# EasyEDA Pro project Commuta_PCBv1.epro

# Schematic Schematic1
Assembly Variant: Basic; Board Name: Board1; Create Date: 2026-05-24; Page Name: P1; Project Name: 便携式空气质量检测设备; Schematic Name: Schematic1; Update Date: 2026-05-24; Company: 嘉立创EDA; Page Size: A4; Version: V1.0
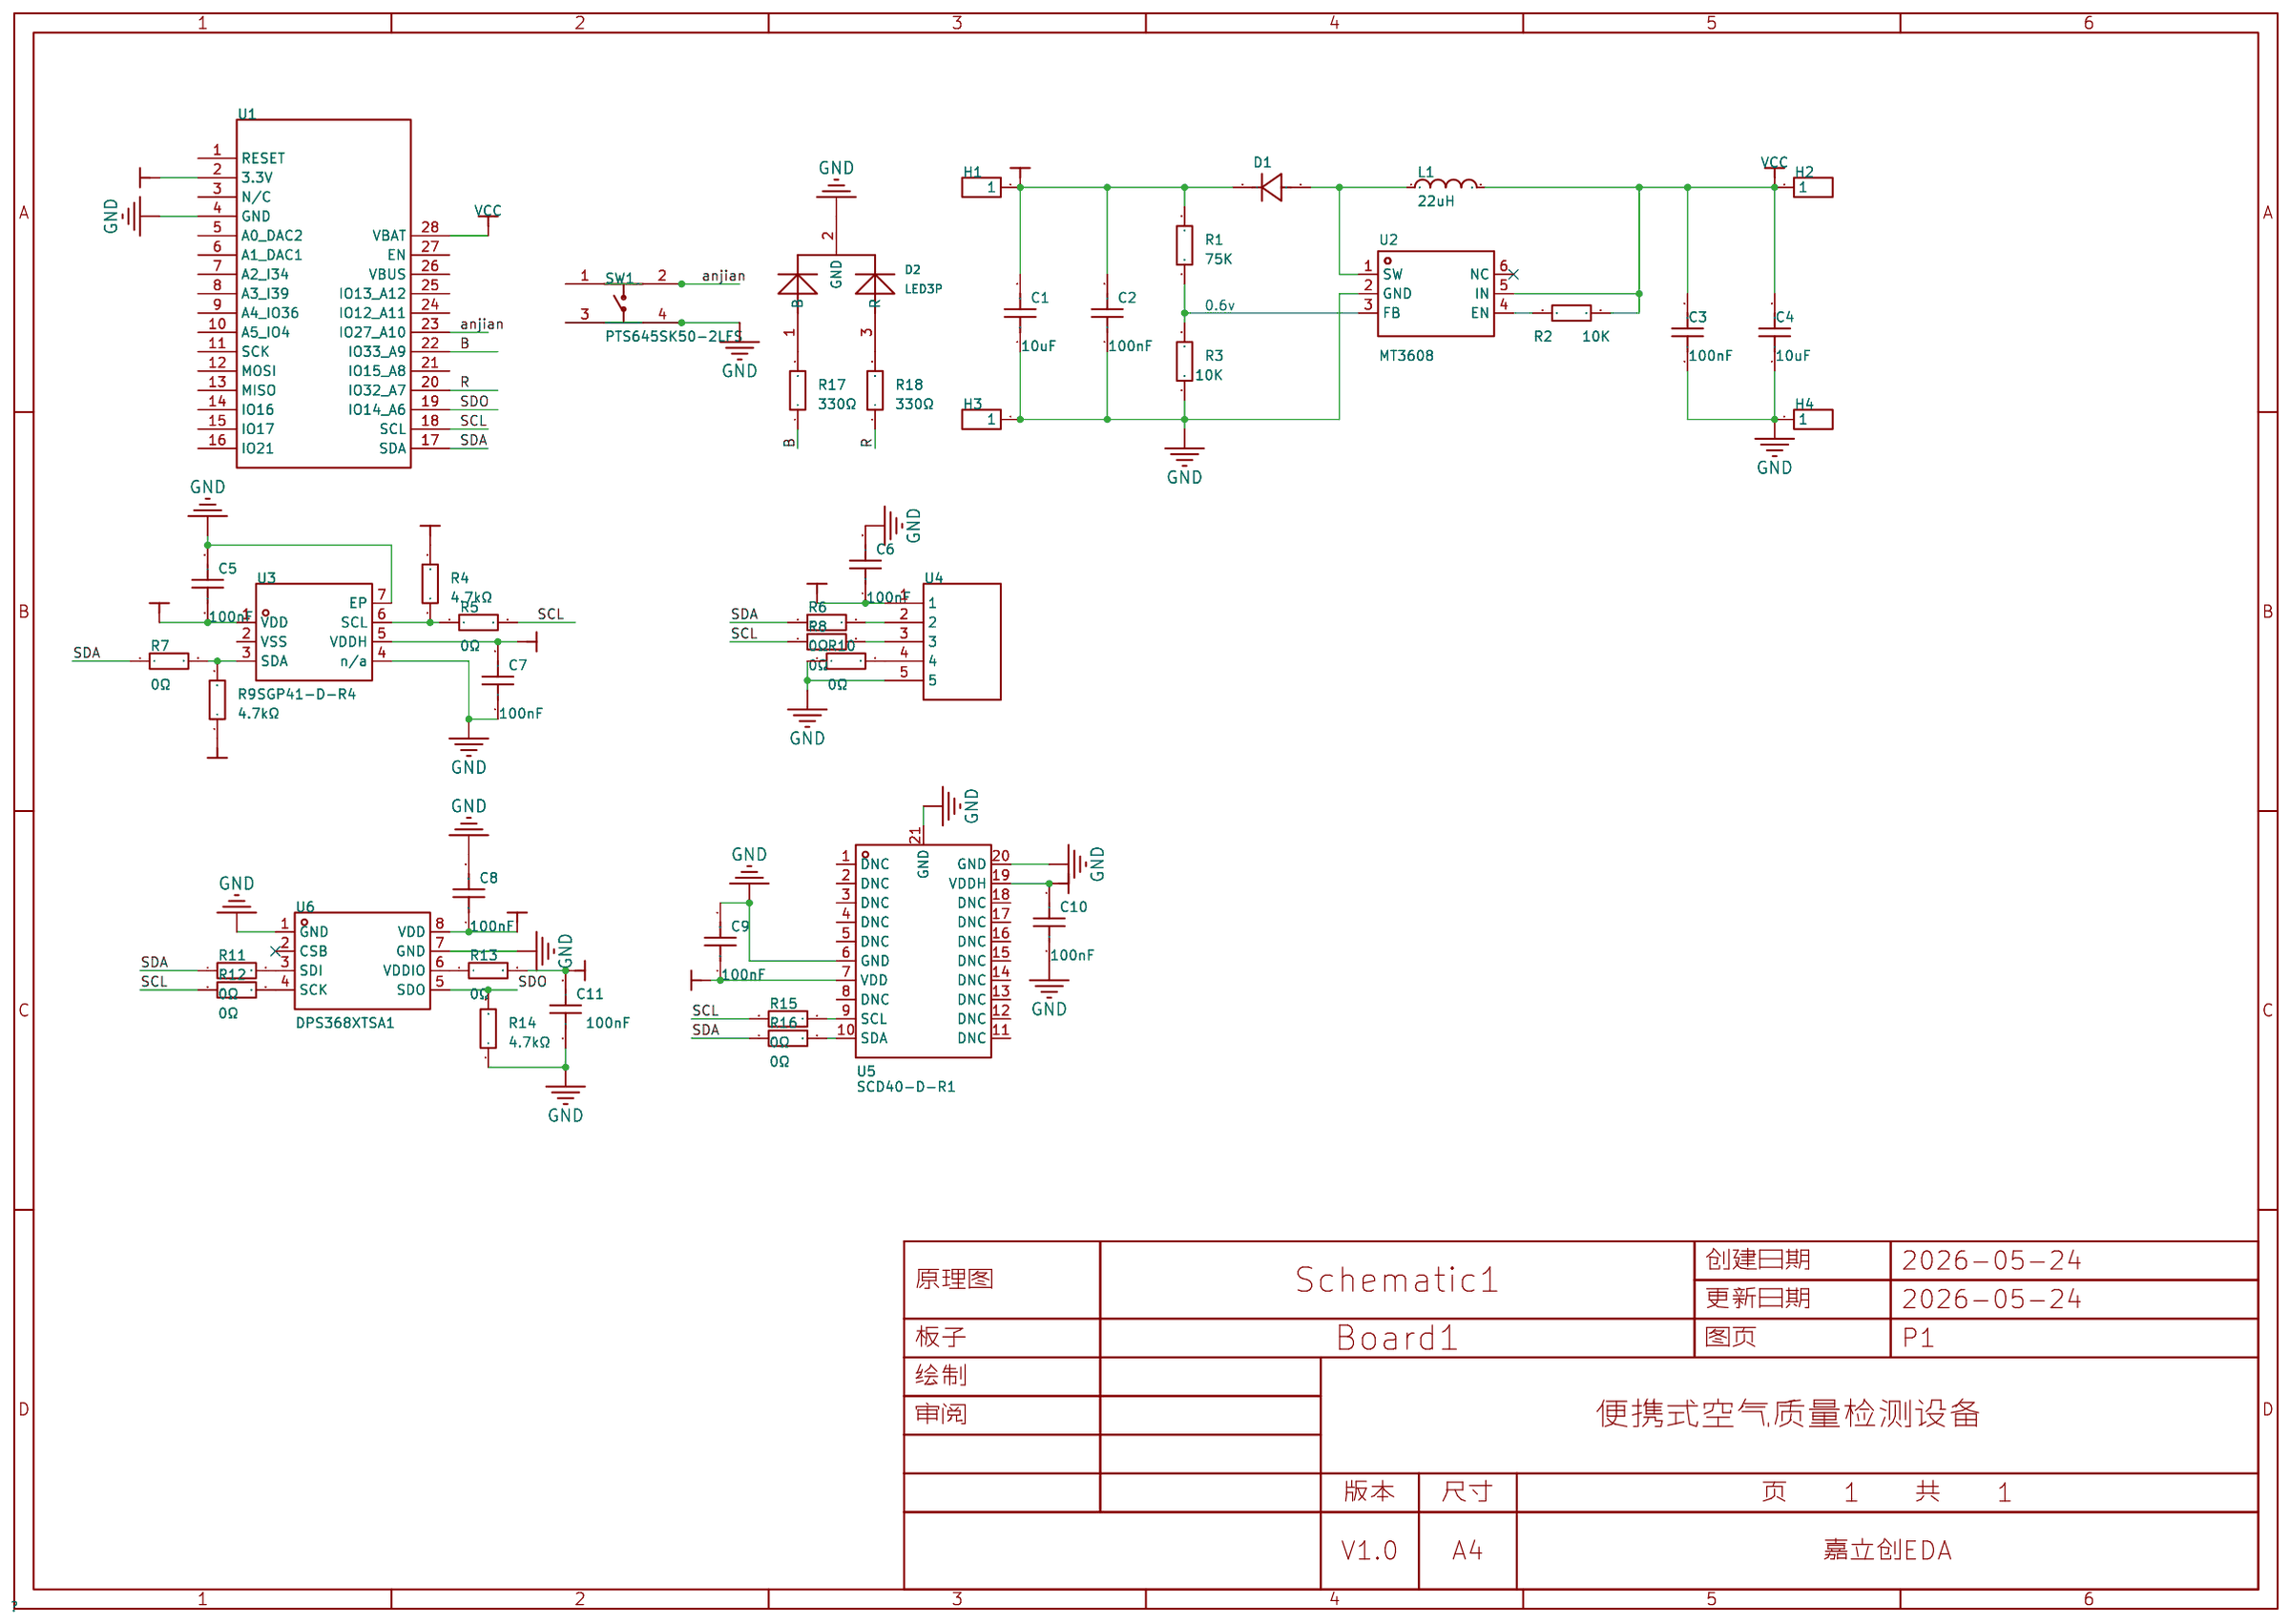
[diagram p0: schematic sheet]

## Parts
C1  10uF  [C0805]
C2  100nF  [C0805]
C3  100nF  [C0805]
C4  10uF  [C0805]
C5  100nF  [C0805]
C6  100nF  [C0805]
C7  100nF  [C0805]
C8  100nF  [C0805]
C9  100nF  [C0805]
C10  100nF  [C0805]
C11  100nF  [C0805]
D1  -  [SMA_1N4007]
D2  LED3P  [LED3P]
H1  -  [HDR-TH_1P-V-M_XKB_X4611WV-01I-C28D40]
H2  -  [HDR-TH_1P-V-M_XKB_X4611WV-01I-C28D40]
H3  -  [HDR-TH_1P-V-M_XKB_X4611WV-01I-C28D40]
H4  -  [HDR-TH_1P-V-M_XKB_X4611WV-01I-C28D40]
L1  22uH  [IND-SMD_L6.0-W5.2_SUMIDA_CDH53]
R1  75K  [R0603]
R2  10K  [R0603]
R3  10K  [R0603]
R4  4.7kΩ  [R0603]
R5  0Ω  [R0603]
R6  0Ω  [R0603]
R7  0Ω  [R0603]
R8  0Ω  [R0603]
R9  4.7kΩ  [R0603]
R10  0Ω  [R0603]
R11  0Ω  [R0603]
R12  0Ω  [R0603]
R13  0Ω  [R0603]
R14  4.7kΩ  [R0603]
R15  0Ω  [R0603]
R16  0Ω  [R0603]
R17  330Ω  [R1206]
R18  330Ω  [R1206]
SW1  PTS645SK50-2LFS  [KEY-TH_4P-L6.0-W6.0-P4.50-LS6.50]
U1  -  [HUZZAH32 ESP32]
U2  MT3608  [SOT-23-6_L2.9-W1.6-P0.95-LS2.8-BL]
U3  SGP41-D-R4  [DFN-6_L2.4-W2.4-P0.80-TL-EP]
U4  -  [CONN-TH_5P-P2.50_HX-2.54MM-5P-ZZ]
U5  SCD40-D-R1  [LGA-20_L10.1-W10.1-P1.25-TL]
U6  DPS368XTSA1  [LGA-8_L2.5-W2.0-P0.65-TR_DPS368]

## Library data of the parts
C1-C11 = CAP_0603: Supplier Footprint: 0603
D1 = D_1N4007: Supplier Footprint: SMA
D2 = LED3P: 双色LED灯
H1-H4 = HDR-M_2.54_1x1P: Supplier Part: C81276; Supplier Footprint: 插件; JLCPCB Part Class: Extended Part
L1 = PCR0530-220-M: 电感值:22uH;精度:±20%;额定电流:2A;饱和电流(Isat):2.5A;类型:一体成型电感;; LCSC Part Name: 22μH ±20% 2A; Supplier Part: C53896868; Manufacturer: JIERR(捷而瑞); Supplier Footprint: SMD,6x5.2mm; JLCPCB Part Class: Extended Part; Datasheet: https://item.szlcsc.com/datasheet/PCR0530-220-M/57092550.html; Supplier: LCSC; Tolerance: ±20%; Current Rating: 2A; Current - Saturation(Isat): 2.5A; DC Resistance(DCR): 260mΩ; Type: 一体成型电感
R1-R3 = Res_0603: Supplier Footprint: 0603
R4 R9 R14 = RC0603FR-074K7L: 电阻类型:厚膜电阻;阻值:4.7kΩ;精度:±1%;功率:100mW;工作电压:75V;温度系数:±100ppm/℃;; LCSC Part Name: 厚膜电阻 4.7kΩ ±1% 100mW; Supplier Part: C99782; Manufacturer: YAGEO(国巨); Supplier Footprint: 0603; JLCPCB Part Class: Extended Part; Datasheet: https://item.szlcsc.com/datasheet/RC0603FR-074K7L/100996.html; Supplier: LCSC; Type: 厚膜电阻; Tolerance: ±1%; Power(Watts): 100mW; Voltage-Supply(Max): 75V; Temperature Coefficient: ±100ppm/℃; Operating Temperature: -55℃~+155℃
R5-R8 R10-R13 R15 R16 = RC0603FR-070RL: 电阻类型:厚膜电阻;阻值:0Ω;精度:±1%;功率:100mW;工作电压:75V;温度系数:-;; LCSC Part Name: 厚膜电阻 0Ω ±1% 100mW; Supplier Part: C100044; Manufacturer: YAGEO(国巨); Supplier Footprint: 0603; JLCPCB Part Class: Extended Part; Datasheet: https://item.szlcsc.com/datasheet/RC0603FR-070RL/101258.html; Supplier: LCSC; Type: 厚膜电阻; Tolerance: ±1%; Power(Watts): 100mW; Voltage-Supply(Max): 75V; Operating Temperature: -55℃~+155℃
R17 R18 = 1206W4J0331T5E: 电阻类型:厚膜电阻;阻值:330Ω;精度:±5%;功率:250mW;工作电压:200V;温度系数:±100ppm/℃;; LCSC Part Name: 330Ω ±5% 250mW 厚膜电阻; Supplier Part: C25374; Manufacturer: UNI-ROYAL(厚声); Supplier Footprint: 1206; JLCPCB Part Class: Extended Part; Datasheet: https://item.szlcsc.com/datasheet/1206W4J0331T5E/26117.html; Supplier: LCSC; Type: 厚膜电阻; Tolerance: ±5%; Power(Watts): 250mW; Voltage-Supply(Max): 200V; Temperature Coefficient: ±100ppm/℃; Operating Temperature: -55℃~+155℃
SW1 = PTS645SK50-2LFS: 电路结构:单刀单掷;按钮形状:圆形按钮;作用力:2.6N;安装方式:直插;开关长度:6mm;开关宽度:6mm;带支架:不带支架;触点电流:50mA;额定电压:12V;带灯:无;工作寿命:10万次;; LCSC Part Name: 6mm*6mm 12V 50mA; Supplier Part: C2689653; Manufacturer: C&K; Supplier Footprint: 插件-4P,6x6mm; JLCPCB Part Class: Extended Part; Datasheet: https://item.szlcsc.com/datasheet/PTS645SK50-2LFS/2796858.html; Supplier: LCSC; Circuit: 单刀单掷; Actuator Style: 圆形按钮; Operating Force: 2.6N; Mounting Type: 直插; Length: 6mm; Width: 6mm; with Bracket: 不带支架; Contact Current: 50mA; Voltage Rating: 12V; With Lamp: 无; Termination Style: PC引脚; Life: 10万次
U1 = HUZZAH32 ESP32
U2 = MT3608: 功能类型:升压型;输入电压:2V~24V;输出电压:28V;输出电流(最大值):-;; LCSC Part Name: 升压型 输入2V~24V 输出28V; Supplier Part: C84817; Manufacturer: 西安航天民芯; Supplier Footprint: SOT-23-6; JLCPCB Part Class: Extended Part; Datasheet: https://atta.szlcsc.com/upload/public/pdf/source/20161110/1478743351706.pdf; Supplier: LCSC; Function: 升压型; Number of Outputs: 1; Topology: 升压式; Input Voltage: 2V~24V; Output Voltage: 28V; Switching Frequency: 1.2MHz
U3 = SGP41-D-R4: VOC（挥发性有机化合物）和Nox （氮氧化合物） 传感器（用于智能调节空气处理设备）; LCSC Part Name: 3.000.060 3.000.060 适用于室内空气质量应用的 VOC 与 NOx 传感器; Supplier Part: C3659325; Manufacturer: Sensirion(瑞士盛思锐); Supplier Footprint: DFN-6(2.4x2.4); JLCPCB Part Class: Extended Part; Datasheet: https://item.szlcsc.com/datasheet/SGP41-D-R4/4227122.html; Supplier: LCSC
U4 = SPS30传感器
U5 = SCD40-D-R1: 气体类型:空气质量;测量范围:0ppm~40000ppm;接口类型:I2C;精度:±5%;; LCSC Part Name: 3.000.496 3.000.496 紧凑且具成本效益的光声式 NDIR CO₂ 二氧化碳传感器; Supplier Part: C3037696; Manufacturer: Sensirion(瑞士盛思锐); Supplier Footprint: SMD; JLCPCB Part Class: Extended Part; Datasheet: https://item.szlcsc.com/datasheet/SCD40-D-R1/3589639.html; Supplier: LCSC; Type: 空气质量; Measurement Range: 0ppm~40000ppm; Voltage - Supply: 2.4V~5.5V; Interface: I2C; Tolerance: ±5%; Operating Temperature: -10℃~+60℃; Length: 10.1mm; Width: 10.1mm; Height: 6.5mm; Current - Supply: 0.36mA; Features: 复位功能
U6 = DPS368XTSA1: 压力范围:30Kpa~1.2bar;接口类型:I2C；SPI;; LCSC Part Name: 数字式气压传感器; Supplier Part: C3232508; Manufacturer: Infineon(英飞凌); Supplier Footprint: VLGA-8(2x2.5); JLCPCB Part Class: Extended Part; Datasheet: https://item.szlcsc.com/datasheet/DPS368XTSA1/3795529.html; Supplier: LCSC; Pressure range: 30Kpa~1.2bar; Voltage - Supply: 1.7V~3.6V; Standby Current: 500nA; Interface: I2C；SPI; Module: 否; Absolute Accuracy: 100pa; Relative Accuracy: 6pa; Features: 待机模式；集成ADC与数字接口；片内温度补偿；片内校准与非易失存储；片内温度输出; Temperature Coefficient of Offset(TCO): 0.5pa/K; Response time: 27.6ms; Operating Temperature: -40℃~+85℃

## Nets
+3.3V: C5.1 C7.2 C8.1 C9.1 C10.2 C11.2 R4.2 R9.1 R13.2 U1.2(3.3V) U3.1(VDD) U3.5(VDDH) U5.7(VDD) U5.19(VDDH) U6.8(VDD)
+5V: C1.2 C2.2 C6.1 D1.1(K) H1.1 R1.2 U4.1
GND: C1.1 C2.1 C3.1 C4.1 C5.2 C6.2 C7.1 C8.2 C9.2 C10.1 C11.1 D2.2(GND) H3.1 H4.1 R3.1 R10.1 R14.1 SW1.3 SW1.4 U1.4(GND) U2.2(GND) U3.4(n/a) U3.7(EP) U4.5 U5.6(GND) U5.20(GND) U5.21(GND) U6.1(GND) U6.7(GND)
VCC: C3.2 C4.2 H2.1 L1.2 R2.2 U1.28(VBAT) U2.5(IN)
anjian: SW1.1 SW1.2 U1.23(IO27_A10)
B: R17.1 U1.22(IO33_A9)
R: R18.1 U1.20(IO32_A7)
SCL: R5.2 R8.1 R12.1 R15.2 U1.18(SCL)
SDA: R6.1 R7.1 R11.1 R16.1 U1.17(SDA)
SDO: R14.2 U1.19(IO14_A6) U6.5(SDO)
$1N2: R2.1 U2.4(EN)
$1N7: R1.1 R3.2 U2.3(FB)
$1N8: D1.2(A) L1.1 U2.1(SW)
$1N12: R11.2 U6.3(SDI)
$1N13: R12.2 U6.4(SCK)
$1N14: R7.2 R9.2 U3.3(SDA)
$1N15: R4.1 R5.1 U3.6(SCL)
$1N22: R13.1 U6.6(VDDIO)
$1N48: R10.2 U4.4
$1N49: R6.2 U4.2
$1N50: R8.2 U4.3
$1N56: R15.1 U5.9(SCL)
$1N57: R16.2 U5.10(SDA)
$1N69: D2.1(B) R17.2
$1N70: D2.3(R) R18.2

Not connected (* = marked no-connect by the designer): U1 1(RESET) 3(N/C) 5(A0_DAC2) 6(A1_DAC1) 7(A2_I34) 8(A3_I39) 9(A4_IO36) 10(A5_IO4) 11(SCK) 12(MOSI) 13(MISO) 14(IO16) 15(IO17) 16(IO21) 21(IO15_A8) 24(IO12_A11) 25(IO13_A12) 26(VBUS) 27(EN); U2 6(NC)*; U3 2(VSS); U5 1(DNC) 2(DNC) 3(DNC) 4(DNC) 5(DNC) 8(DNC) 11(DNC) 12(DNC) 13(DNC) 14(DNC) 15(DNC) 16(DNC) 17(DNC) 18(DNC); U6 2(CSB)*

## Notes on the sheet
- 0.6v

# Board PCB1
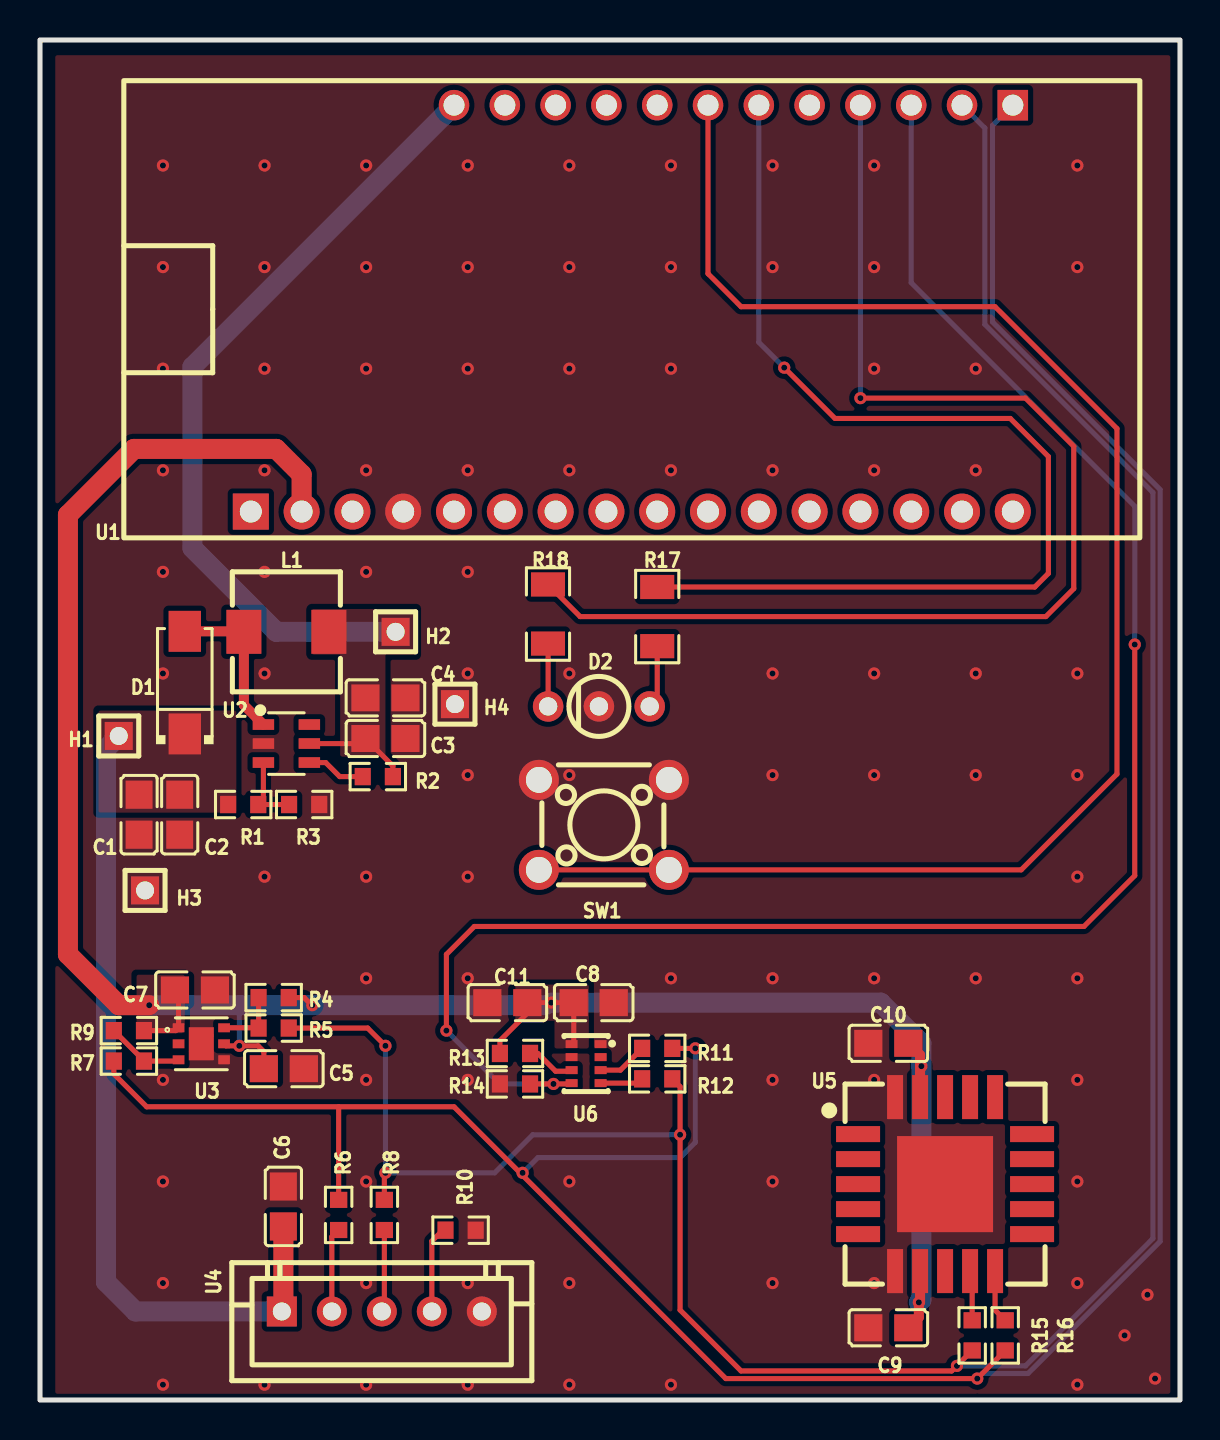
[diagram p1: board, top side]
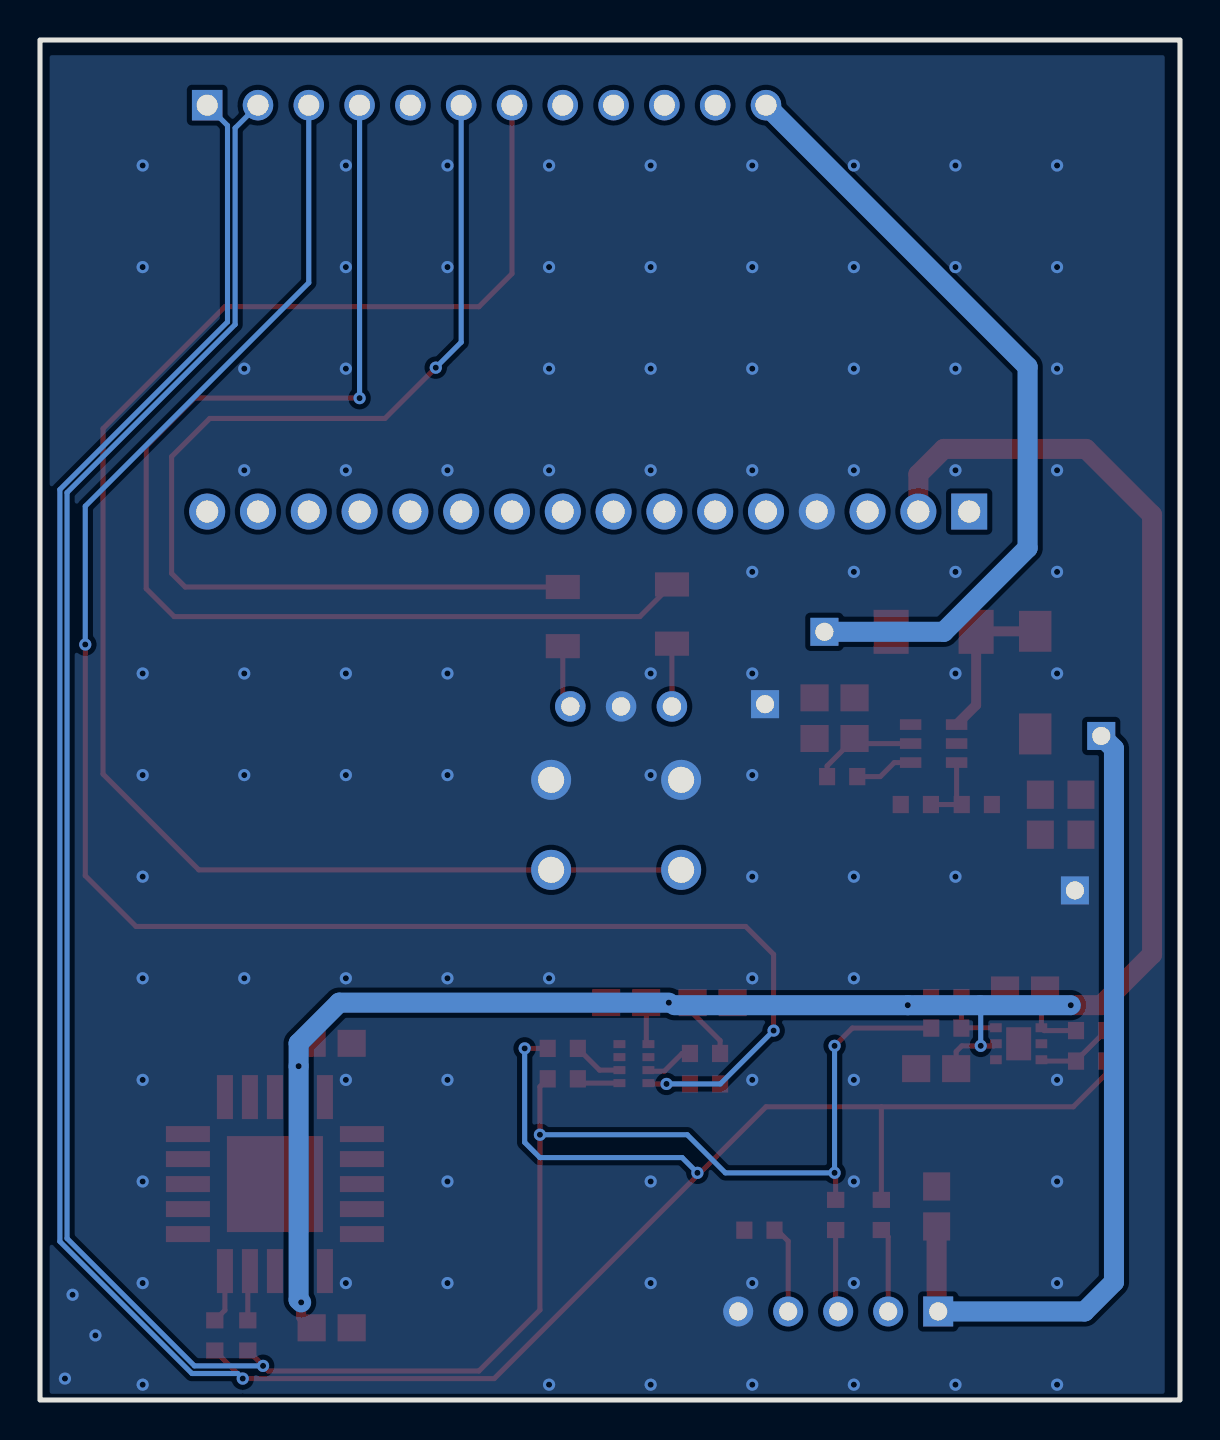
[diagram p2: board, bottom side, seen from below]

Outline 57 x 68 mm; copper layers: Top Layer, Bottom Layer. Coordinates in mm from the lower left corner of the outline.
Outline path: rectangle 0,68 57,0
Stack: Top Layer 0.035mm / Dielectric1 1.51mm FR4 er 4.5 / Bottom Layer 0.035mm

## Design rules (mm)
spacing copperThickness1oz (default): track to track 0.102, other pairs 0.152 to 0.3
spacing copperThickness2oz: track to track 0.203, other pairs 0.152 to 0.3
track width copperThickness1oz (default): min 0.127, default 0.254, max 2.54
track width copperThickness2oz: min 0.203, default 0.254, max 2.54
differential pair differentialPair (default): width min 0.127, default 0.254, max 2.54; gap min 0.152, default 0.152
net +3.3V uses copperRegion_copperThickness2oz, copperThickness2oz
pour e222 uses copperRegion_copperThickness2oz, copperThickness2oz
net GND uses copperRegion_copperThickness1oz
net VCC uses copperRegion_copperThickness1oz
net +5V uses copperRegion_copperThickness1oz

## Placement (name value [footprint] x y rotation side)
C1  10uF  [C0805]  4.95 29.27 90 top
C2  100nF  [C0805]  6.98 29.27 90 top
C3  100nF  [C0805]  17.27 33.08 180 top
C4  10uF  [C0805]  17.27 35.11 180 top
C5  100nF  [C0805]  12.19 16.57 0 top
C6  100nF  [C0805]  12.17 9.68 90 top
C7  100nF  [C0805]  7.75 20.5 180 top
C8  100nF  [C0805]  27.69 19.87 0 top
C9  100nF  [C0805]  42.42 3.61 180 top
C10  100nF  [C0805]  42.42 17.84 0 top
C11  100nF  [C0805]  23.37 19.87 0 top
D1  -  [SMA_1N4007]  7.24 35.87 90 top
D2  -  [LED3P]  30.49 34.68 180 top
H1  -  [HDR-TH_1P-V-M_XKB_X4611WV-01I-C28D40]  3.94 33.2 90 top
H2  -  [HDR-TH_1P-V-M_XKB_X4611WV-01I-C28D40]  17.78 38.41 90 top
H3  -  [HDR-TH_1P-V-M_XKB_X4611WV-01I-C28D40]  5.25 25.48 90 top
H4  -  [HDR-TH_1P-V-M_XKB_X4611WV-01I-C28D40]  20.75 34.79 90 top
L1  22uH  [IND-SMD_L6.0-W5.2_SUMIDA_CDH53]  12.32 38.41 90 top
R1  75K  [R0603]  10.16 29.77 180 top
R2  10K  [R0603]  16.89 31.17 0 top
R3  10K  [R0603]  13.21 29.77 180 top
R4  4.7kΩ  [R0603]  11.68 20.12 0 top
R5  0Ω  [R0603]  11.68 18.6 0 top
R6  0Ω  [R0603]  14.93 9.25 270 top
R7  0Ω  [R0603]  4.44 16.95 0 top
R8  0Ω  [R0603]  17.22 9.25 270 top
R9  4.7kΩ  [R0603]  4.44 18.47 180 top
R10  0Ω  [R0603]  21.03 8.49 180 top
R11  0Ω  [R0603]  30.86 17.58 180 top
R12  0Ω  [R0603]  30.86 16.06 180 top
R13  0Ω  [R0603]  23.75 17.33 180 top
R14  4.7kΩ  [R0603]  23.75 15.8 0 top
R15  0Ω  [R0603]  46.61 3.23 270 top
R16  0Ω  [R0603]  48.26 3.23 90 top
R17  330Ω  [R1206]  30.86 39.17 270 top
R18  330Ω  [R1206]  25.4 39.3 270 top
SW1  PTS645SK50-2LFS  [KEY-TH_4P-L6.0-W6.0-P4.50-LS6.50]  28.19 28.76 180 top
U1  -  [HUZZAH32 ESP32]  54.99 43.11 90 top
U2  MT3608  [SOT-23-6_L2.9-W1.6-P0.95-LS2.8-BL]  12.32 32.82 270 top
U3  SGP41-D-R4  [DFN-6_L2.4-W2.4-P0.80-TL-EP]  8.07 17.81 0 top
U4  -  [CONN-TH_5P-P2.50_HX-2.54MM-5P-ZZ]  17.09 4.43 0 top
U5  SCD40-D-R1  [LGA-20_L10.1-W10.1-P1.25-TL]  45.25 10.8 0 top
U6  DPS368XTSA1  [LGA-8_L2.5-W2.0-P0.65-TR_DPS368]  27.31 16.82 0 top

## Footprints (pads in the part's own frame, mm; a bottom-side part is the same pattern mirrored in y, then rotated)
C0805
  rect 1.41x1.35 smd: 1(-1,0) 2(1,0)
CONN-TH_5P-P2.50_HX-2.54MM-5P-ZZ
  rect 1.5x1.5 hole 0.9: 1(-5,0)
  round 1.5 hole 0.9: 2(-2.5,0) 3(0,0) 4(2.5,0) 5(5,0)
DFN-6_L2.4-W2.4-P0.80-TL-EP
  rect 0.585x0.448 smd: 1(-1.137,0.8) 2(-1.137,0) 3(-1.137,-0.8) 4(1.137,-0.8) 5(1.137,0) 6(1.137,0.8)
  rect 1.25x1.65 smd: 7(0,0)
HDR-TH_1P-V-M_XKB_X4611WV-01I-C28D40
  rect 1.4x1.4 hole 0.9: 1(0,0)
HUZZAH32 ESP32
  rect 1.8x1.8 hole 1.1: 1(1.313,44.45)
  round 1.8 hole 1.1: 2(1.313,41.91) 3(1.313,39.37) 4(1.313,36.83) 5(1.313,34.29) 6(1.313,31.75) 7(1.313,29.21) 8(1.313,26.67) 9(1.313,24.13) 10(1.313,21.59) 11(1.313,19.05) 12(1.313,16.51) 13(1.313,13.97) 14(1.313,11.43) 15(1.313,8.89) 16(1.313,6.35)
  rect 1.524x1.524 hole 1.05: 17(21.634,6.35)
  round 1.524 hole 1.05: 18(21.634,8.89) 19(21.634,11.43) 20(21.634,13.97) 21(21.634,16.51) 22(21.634,19.05) 23(21.634,21.59) 24(21.634,24.13) 25(21.634,26.67) 26(21.634,29.21) 27(21.634,31.75) 28(21.634,34.29)
IND-SMD_L6.0-W5.2_SUMIDA_CDH53
  rect 2.2x1.75 smd: 1(0,2.125) 2(0,-2.125)
KEY-TH_4P-L6.0-W6.0-P4.50-LS6.50
  round 2 hole 1.3: 1(-3.25,2.25) 2(3.25,2.25) 3(-3.25,-2.25) 4(3.25,-2.25)
LED3P
  round 1.524 hole 0.914: 1(0,0) 2(2.54,0) 3(5.08,0)
LGA-8_L2.5-W2.0-P0.65-TR_DPS368
  rect 0.6x0.4 smd: 1(0.725,0.975) 2(0.725,0.325) 3(0.725,-0.325) 4(0.725,-0.975) 5(-0.725,-0.975) 6(-0.725,-0.325) 7(-0.725,0.325) 8(-0.725,0.975)
LGA-20_L10.1-W10.1-P1.25-TL
  rect 2.2x0.8 smd: 1(-4.35,2.5) 2(-4.35,1.25) 3(-4.35,0) 4(-4.35,-1.25) 5(-4.35,-2.5) 11(4.35,-2.5) 12(4.35,-1.25) 13(4.35,0) 14(4.35,1.25) 15(4.35,2.5)
  rect 0.8x2.2 smd: 6(-2.5,-4.35) 7(-1.25,-4.35) 8(0,-4.35) 9(1.25,-4.35) 10(2.5,-4.35) 16(2.5,4.35) 17(1.25,4.35) 18(0,4.35) 19(-1.25,4.35) 20(-2.5,4.35)
  rect 4.8x4.8 smd: 21(0,0)
R0603
  rect 0.806x0.864 smd: 1(-0.753,0) 2(0.753,0)
R1206
  rect 1.208x1.701 smd: 1(-1.479,0) 2(1.479,0)
SMA_1N4007
  rect 2.046x1.62 smd: 1(-2.566,0) 2(2.566,0)
SOT-23-6_L2.9-W1.6-P0.95-LS2.8-BL
  rect 0.532x1.072 smd: 1(-0.95,-1.149) 2(0,-1.149) 3(0.95,-1.149) 4(0.95,1.149) 5(0,1.149) 6(-0.95,1.149)

## Nets
As in the schematic.

Pads without a net: U1 1 3 5 6 7 8 9 10 11 12 13 14 15 16 21 24 25 26 27; U2 6; U3 2; U5 1 2 3 4 5 8 11 12 13 14 15 16 17 18; U6 2

## Via types
v1: diameter 0.61, hole 0.305, Top Layer to Bottom Layer, 110 vias

## Routing (per net, layer and track width the routed paths; a pad name or vN(x,y) marks a point on that pad's centre or on a via; arc(x,y) is an arc through that point)
+3.3V: length 118.2
  Top Layer w0.254: C7.2 6.93,20.32 U3.1 6.79,18.47 R9.1 ; R4.2 13.21,20.12 13.59,19.74 ; U6.8 26.69,17.9 C8.1 v1(25.56,19.87) C11.2 24.37,19.34 23,17.97 R13.2 ; U3.5 9.31,17.71 v1(9.96,17.71) 10.91,17.71 11.19,17.42 11.19,16.69
  Top Layer w0.5: v1(43.94,4.88) 43.94,4.14 C9.1 ; U5.19 44,17.25 C10.2 ; 44,4.88 U5.7
  Top Layer w1: v1(5.46,19.74) 3.94,19.74 1.4,22.28 1.4,44.25 4.7,47.55 11.81,47.55 13.08,46.28 U1.2
  Bottom Layer w0.254: 9.99,19.74 9.96,19.71 v1(9.96,17.71)
  Bottom Layer w1: v1(25.56,19.87) 42.04,19.87 44.07,17.84 v1(44.07,16.69) 44.07,5.01 v1(43.94,4.88) ; 25.27,19.74 v1(13.61,19.74) v1(5.46,19.74)
+5V: length 41.2
  Top Layer w1: C6.1 12.17,4.51 U4.1
  Bottom Layer w1: H1.1 3.3,32.57 3.3,5.9 4.77,4.43 U4.1
GND:
  vias: v1(6.15,61.73) v1(6.15,56.65) v1(6.15,51.57) v1(6.15,46.49) v1(6.15,41.41) v1(6.15,36.33) v1(6.15,16.01) v1(6.15,10.93) v1(6.15,5.85) v1(6.15,0.77) v1(11.23,61.73) v1(11.23,56.65) v1(11.23,51.57) v1(11.23,46.49) v1(11.23,41.41) v1(11.23,36.33) v1(11.23,26.17) v1(11.23,0.77) v1(16.31,61.73) v1(16.31,56.65) v1(16.31,51.57) v1(16.31,46.49) v1(16.31,41.41) v1(16.31,26.17) v1(16.31,21.09) v1(16.31,16.01) v1(16.31,10.93) v1(16.31,5.85) v1(16.31,0.77) v1(21.39,61.73) v1(21.39,56.65) v1(21.39,51.57) v1(21.39,46.49) v1(21.39,41.41) v1(21.39,36.33) v1(21.39,31.25) v1(21.39,26.17) v1(21.39,21.09) v1(21.39,16.01) v1(21.39,5.85) v1(21.39,0.77) v1(26.47,61.73) v1(26.47,56.65) v1(26.47,51.57) v1(26.47,46.49) v1(26.47,36.33) v1(26.47,31.25) v1(26.47,10.93) v1(26.47,5.85) v1(26.47,0.77) v1(31.55,61.73) v1(31.55,56.65) v1(31.55,51.57) v1(31.55,46.49) v1(31.55,21.09) v1(31.55,0.77) v1(36.63,61.73) v1(36.63,56.65) v1(36.63,46.49) v1(36.63,36.33) v1(36.63,31.25) v1(36.63,21.09) v1(36.63,16.01) v1(36.63,10.93) v1(36.63,5.85) v1(41.71,61.73) v1(41.71,56.65) v1(41.71,51.57) v1(41.71,46.49) v1(41.71,36.33) v1(41.71,31.25) v1(41.71,21.09) v1(41.71,16.01) v1(41.71,5.85) v1(46.79,51.57) v1(46.79,46.49) v1(46.79,36.33) v1(46.79,31.25) v1(46.79,21.09) v1(51.87,61.73) v1(51.87,56.65) v1(51.87,36.33) v1(51.87,31.25) v1(51.87,26.17) v1(51.87,21.09) v1(51.87,16.01) v1(51.87,10.93) v1(51.87,5.85) v1(51.87,0.77) v1(54.23,3.23) v1(55.37,5.26) v1(55.75,1.07)
VCC: length 44.8
  Top Layer w0.254: U2.5 16.02,32.82 C3.2 17.64,31.7 R2.2
  Bottom Layer w1: H2.1 11.81,38.41 7.62,42.6 7.62,51.66 U1.28
ANJIAN: length 41.4
  Top Layer w0.254: 53.85,48.57 53.85,31.3 ; 24.94,26.51 31.44,26.51 49.06,26.51
anjian: length 38.9
  Top Layer w0.254: 49.06,26.51 53.85,31.3 ; 53.85,48.57 47.75,54.67 35.05,54.67 33.4,56.32 U1.23
B: length 54.4
  Top Layer w0.254: R17.1 49.74,40.65 50.42,41.33 50.42,47.17 48.51,49.08 39.75,49.08 v1(37.21,51.62)
  Bottom Layer w0.254: U1.22 35.94,52.89 v1(37.21,51.62)
R: length 61
  Top Layer w0.254: R18.1 27.01,39.17 50.29,39.17 51.69,40.57 51.69,47.68 49.28,50.09 v1(41.02,50.09)
  Bottom Layer w0.254: v1(41.02,50.09) U1.20
SCL: length 129.5
  Top Layer w0.254: R5.2 16.38,18.6 v1(17.27,17.71) ; R15.2 45.58,1.45 35.05,1.45 32,4.5 v1(32,13.26) 32,15.67 R12.1 ; R8.1 17.22,11.41
  Bottom Layer w0.254: v1(17.27,17.71) v1(17.27,11.36) 22.73,11.36 24.64,13.26 v1(32,13.26) ; U1.18 47.24,63.6 47.24,53.78 55.65,45.37 55.65,8.08 49.28,1.71 v1(45.85,1.71)
SDA: length 144.6
  Top Layer w0.254: 14.93,14.66 20.7,14.66 34.29,1.07 v1(46.86,1.07) 48.26,2.47 R16.1 ; 14.93,14.66 R6.1 ; 14.93,14.66 5.33,14.66 3.69,16.3 R7.1 ; R11.1 v1(32.77,17.58)
  Bottom Layer w0.254: v1(46.86,1.07) 47.12,1.33 49.4,1.33 56.01,7.93 56.01,45.52 47.62,53.9 47.62,63.73 U1.17 ; v1(24.13,11.36) 24.89,12.12 32,12.12 32.77,12.88 v1(32.77,17.58)
SDO: length 91.4
  Top Layer w0.254: U6.5 26.54,15.8 v1(25.67,15.8) R14.2 ; v1(20.32,18.47) 20.32,22.28 21.72,23.68 52.2,23.68 54.74,26.22 v1(54.74,37.77)
  Bottom Layer w0.254: U1.19 43.56,55.86 54.74,44.69 54.74,37.9 ; v1(25.67,15.8) 22.99,15.8 v1(20.32,18.47)
$1N2: length 3
  Top Layer w0.254: R2.1 14.99,31.17 14.28,31.87 U2.4
$1N7: length 3.7
  Top Layer w0.254: U2.3 11.17,30.03 R1.1 R3.2
$1N8: length 8
  Top Layer w0.5: D1.2 10.17,38.43 L1.1 10.19,34.75 U2.1
$1N12: length 2.5
  Top Layer w0.254: R11.2 29.02,16.49 U6.3
$1N13: length 2.2
  Top Layer w0.254: R12.2 29.89,15.84 U6.4
$1N14: length 3.9
  Top Layer w0.254: R9.2 5.2,16.96 R7.2 6.86,16.95 U3.3
$1N15: length 3.3
  Top Layer w0.254: R4.1 10.93,18.6 10.9,18.57 10.86,18.61 U3.6
$1N22: length 2.5
  Top Layer w0.254: U6.6 26.52,16.44 25.78,16.44 24.89,17.33 R13.1
$1N48: length 4.5
  Top Layer w0.254: 20.27,8.62 19.59,7.94 U4.4
$1N49: length 4.2
  Top Layer w0.254: 14.93,8.5 14.59,8.16 U4.2
$1N50: length 4.1
  Top Layer w0.254: 17.22,8.5 17.22,4.55 U4.3
$1N56: length 2.5
  Top Layer w0.254: R15.1 46.61,6.34 U5.9
$1N57: length 2.7
  Top Layer w0.254: U5.10 47.75,4.49 R16.2
$1N69: length 3.2
  Top Layer w0.254: D2.1 30.86,35.06 R17.2
$1N70: length 3.1
  Top Layer w0.254: R18.2 25.41,37.81 D2.3

## Copper pours and planes (outline as drawn; the poured copper is in the pictures)
+3.3V on Top Layer: 25.72,20.18 27.44,20.18 27.44,17.58 25.72,17.58
+3.3V on Top Layer: 4.83,21.26 7.24,21.26 7.24,18.34 4.83,18.34
+3.3V on Top Layer: 23.77,20.77 27.44,20.77 27.44,18.96 23.77,18.96
+5V on Top Layer: 2.92,34.47 9.81,34.47 9.81,29.37 2.92,29.37
GND on Top Layer: 0.76,67.24 56.51,67.24 56.51,0.31 0.76,0.31
GND on Bottom Layer: 0.76,67.24 56.51,67.24 56.51,0.31 0.76,0.31
VCC on Top Layer: 13.59,39.55 18.8,39.55 18.8,37.27 13.59,37.27
VCC on Top Layer: 15.01,38.41 17.27,38.41 17.27,32.17 15.01,32.17
